# EAGLE design untitled (EAGLE 9.6.2)
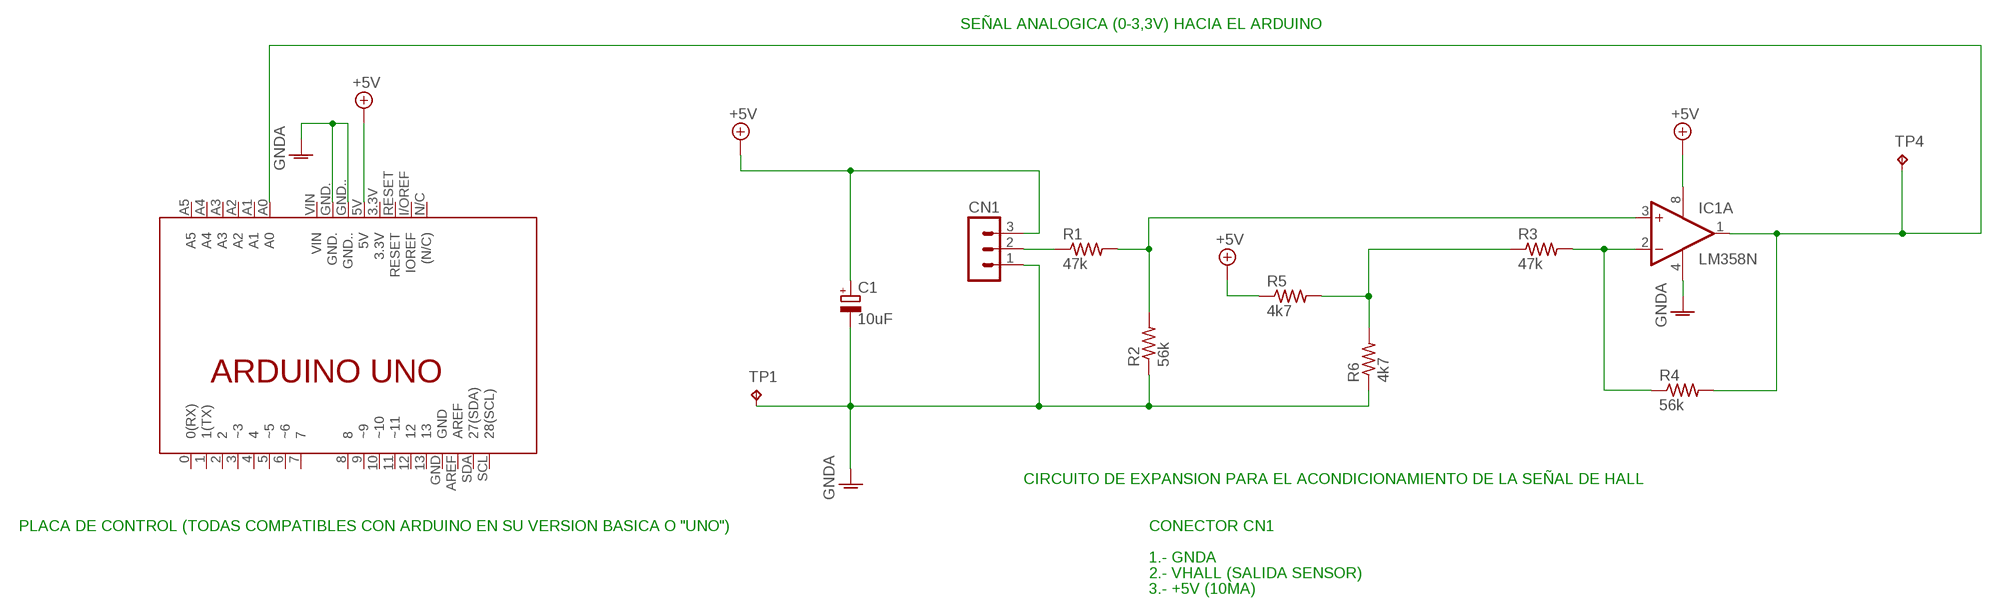
[diagram p0: schematic, sheet 1]

## Parts
C1  10uF  CPOL-EUE5-10.5  [E5-10,5]
CN1  MA03-1  [MA03-1]
IC1  LM358N  [DIL08]
R1  47k  R-US_R1206W  [R1206W]
R2  56k  R-US_R1206W  [R1206W]
R3  47k  R-US_R1206W  [R1206W]
R4  56k  R-US_R1206W  [R1206W]
R5  4k7  R-US_R1206W  [R1206W]
R6  4k7  R-US_R1206W  [R1206W]
TP1  TPPAD1-13Y  [P1-13Y]
TP4  TPPAD1-13Y  [P1-13Y]
U$1  ARDUINO_UNO_SPL  [ARDUINO_UNO_REC]

## Nets
+5V: C1.+ CN1.3 IC1.8(P:V+) R5.1 U$1.5V
GNDA: C1.- CN1.1 IC1.4(P:V-) R2.1 R6.1 TP1.TP U$1.GND. U$1.GND..
N$1: CN1.2 R1.1
N$2: R3.1 R5.2 R6.2
N$3: IC1.3(A:+IN) R1.2 R2.2
N$4: IC1.2(A:-IN) R3.2 R4.1
N$6: IC1.1(A:OUT) R4.2 TP4.TP U$1.A0
Unconnected: IC1.5(B:+IN) IC1.6(B:-IN) IC1.7(B:OUT) U$1.0(0(RX)) U$1.1(1(TX)) U$1.2 U$1.3(~3) U$1.3.3V U$1.4 U$1.5(~5) U$1.6(~6) U$1.7 U$1.8 U$1.9(~9) U$1.10(~10) U$1.11(~11) U$1.12 U$1.13 U$1.A1 U$1.A2 U$1.A3 U$1.A4 U$1.A5 U$1.AREF U$1.GND U$1.I/OREF(IOREF) U$1.N/C((N/C)) U$1.RESET U$1.SCL(28(SCL)) U$1.SDA(27(SDA)) U$1.VIN

## Notes on the sheet
- SEÑAL ANALOGICA (0-3,3V) HACIA EL ARDUINO
- CIRCUITO DE EXPANSION PARA EL ACONDICIONAMIENTO DE LA SEÑAL DE HALL
- PLACA DE CONTROL (TODAS COMPATIBLES CON ARDUINO EN SU VERSION BASICA O "UNO") | CONECTOR CN1
- 1.- GNDA
- 2.- VHALL (SALIDA SENSOR)
- 3.- +5V (10MA)

## Library data of the parts
C1 = shield_flotador:CPOL-EU: POLARIZED CAPACITOR, European symbol
CN1 = con-lstb:MA03-1: PIN HEADER; OC_FARNELL: unknown; OC_NEWARK: unknown
IC1 = shield_flotador:LM358: OP AMP also LM158; LM258; LM2904 Source: http://cache.national.com/ds/LM/LM158.pdf
R1-R6 = shield_flotador:R-US_: RESISTOR, American symbol
TP1 TP4 = shield_flotador:TP: Test pad
U$1 = shield_flotador:ARDUINO_UNO_SPL

## Board
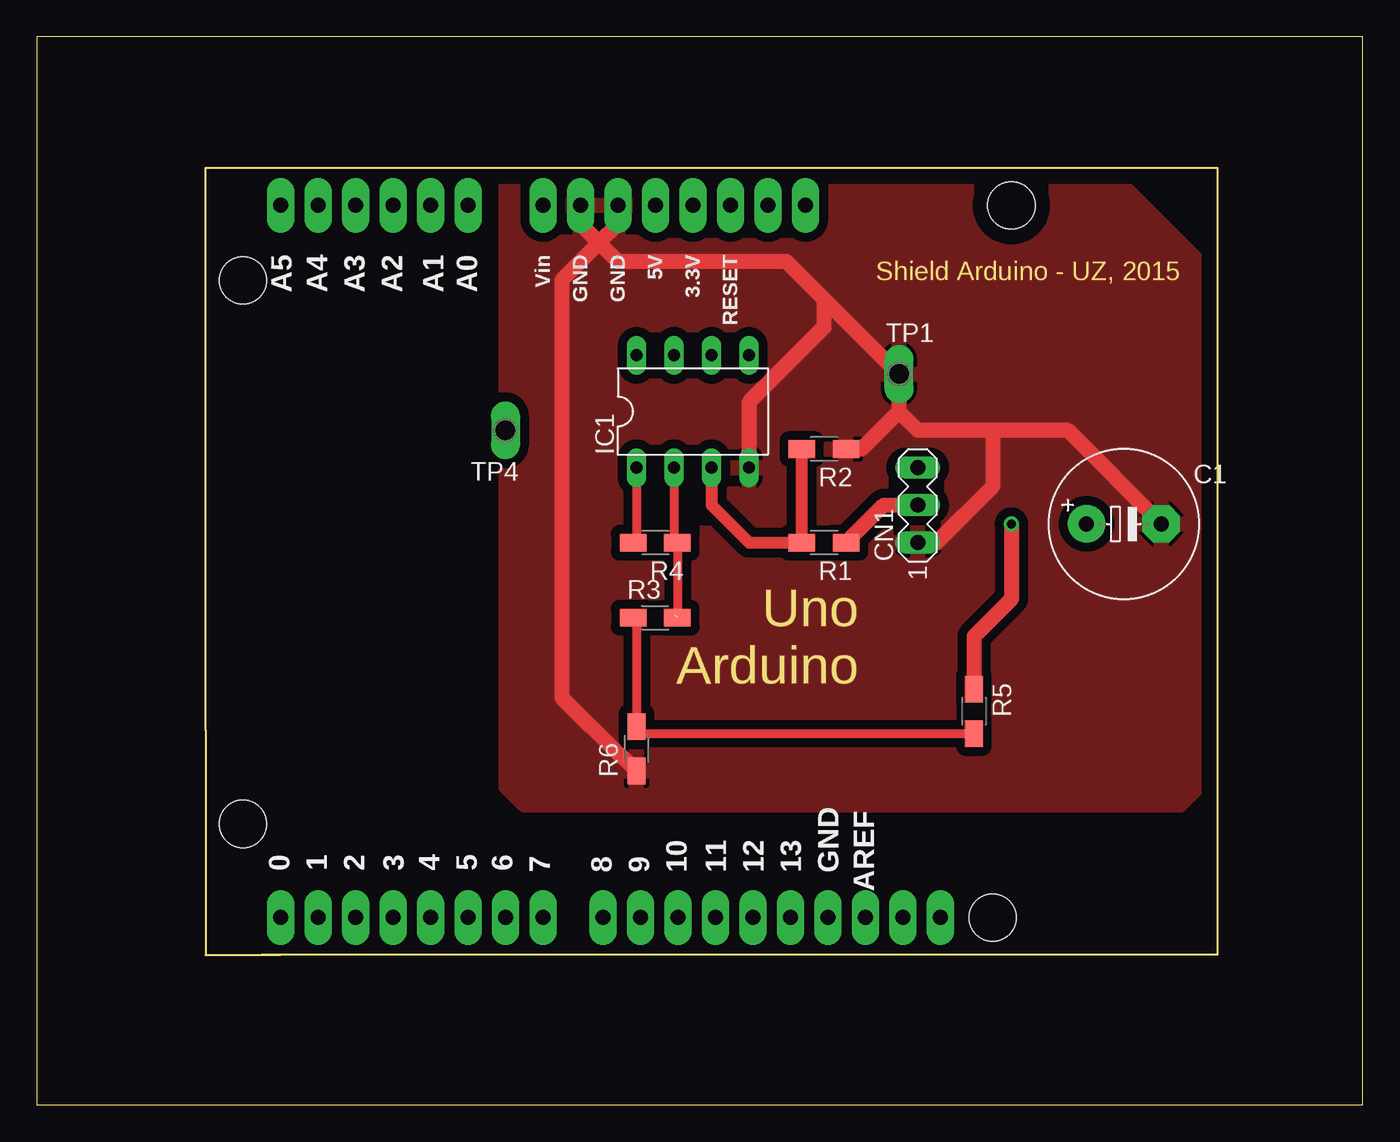
[diagram p1: board, top side]
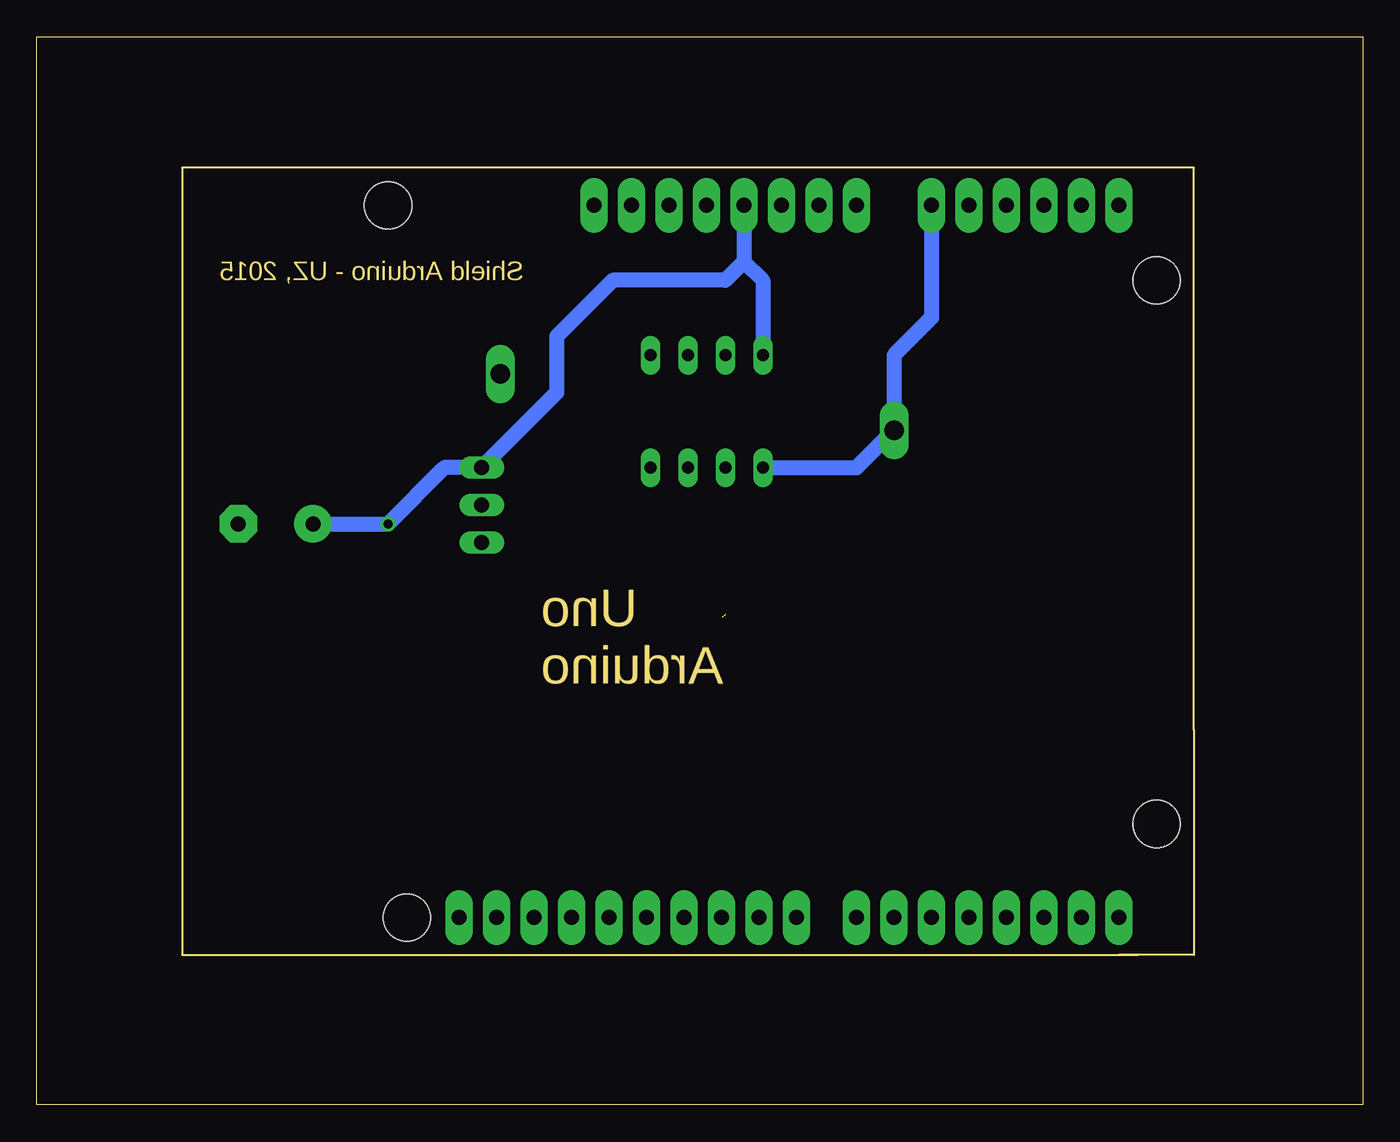
[diagram p2: board, bottom side, seen from below]

Size 89.84 x 72.38 mm. Coordinates in mm from the lower left corner, seen from the top.
Outline: 0,0 89.84,0 89.84,72.38 0,72.38 0,0
Copper layers (1*16): Top 0.035mm / dielectric 1.5mm / Bottom 0.035mm
Design rules "default *": minimum track width 24mil, minimum drill 24mil, track to track 24mil, track to pad 24mil, pad to pad 24mil, via to via 24mil, smd to smd 24mil, copper to edge 40mil, drill to drill 6mil, minimum pad ring 10mil, minimum via ring 8mil, stop-mask expansion 4mil, vias tented up to drill 0mil, thermal gap 10mil

### Footprints (pad centres in the part's own frame; a part is rotated, then mirrored left to right if it is on the bottom)
E5-10,5 = drill 1.016 pad 2.54: + -2.54,0 | drill 1.016 pad 2.54 octagon: - 2.54,0
MA03-1 = drill 1.016 long: 1 -2.54,0; 2 0,0; 3 2.54,0
DIL08 = drill 0.813 pad 1.27 long: 1 -3.81,-3.81; 2 -1.27,-3.81; 3 1.27,-3.81; 4 3.81,-3.81; 5 3.81,3.81; 6 1.27,3.81; 7 -1.27,3.81; 8 -3.81,3.81
R1206W = smd 1.8 x 1.2: 1 -1.499,0; 2 1.499,0
P1-13Y = drill 1.321 pad 1.905 long: TP 0,0
ARDUINO_UNO_REC = drill 1.016 pad 1.88 long: 0 50.8,12.7; 1 48.26,12.7; 2 45.72,12.7; 3 43.18,12.7; 3.3V 22.86,-35.56; 4 40.64,12.7; 5 38.1,12.7; 5V 25.4,-35.56; 6 35.56,12.7; 7 33.02,12.7; 8 28.956,12.7; 9 26.416,12.7; 10 23.876,12.7; 11 21.336,12.7; 12 18.796,12.7; 13 16.256,12.7; A0 38.1,-35.56; A1 40.64,-35.56; A2 43.18,-35.56; A3 45.72,-35.56; A4 48.26,-35.56; A5 50.8,-35.56; AREF 11.176,12.7; GND 13.716,12.7; GND. 30.48,-35.56; GND.. 27.94,-35.56; I/OREF 17.78,-35.56; N/C 15.24,-35.56; RESET 20.32,-35.56; SCL 6.096,12.7; SDA 8.636,12.7; VIN 33.02,-35.56 | hole 3.2: 53.34,-30.48; 53.34,6.35; 2.54,12.7; 1.27,-35.56

### Placement (x,y rotation side)
C1  73.66,39.37 0 top
CN1  59.69,40.64 90 top
IC1  44.45,46.99 0 top
R1  53.34,38.1 180 top
R2  53.34,44.45 180 top
R3  41.91,33.02 0 top
R4  41.91,38.1 180 top
R5  63.5,26.67 270 top
R6  40.64,24.13 90 top
TP1  58.42,49.53 0 top
TP4  31.75,45.72 180 top
U$1  67.31,25.4 180 top

### Tracks (layer width: path | path; a pad name or v marks a point on that pad's centre or on a via)
+5V  (via drill 0.61)
  Top 1.016: v66.04,39.37 66.04,34.29 63.5,31.75 R5.1
  Bottom 1.016: U$1.5V 41.91,57.15 | 41.91,57.15 40.64,55.88 IC1.8 | 41.91,57.15 43.18,55.88 50.8,55.88 54.61,52.07 54.61,48.26 CN1.3 62.23,43.18 v66.04,39.37 C1.+
GNDA
  Top 1.016: 53.34,54.61 TP1.TP 58.42,46.99 | 53.34,54.61 50.8,57.15 39.37,57.15 38.1,58.42 | U$1.GND. 36.83,59.69 38.1,58.42 | U$1.GND.. 39.37,59.69 38.1,58.42 | 58.42,46.99 55.88,44.45 R2.1 | 58.42,46.99 59.69,45.72 64.77,45.72 | C1.- 69.85,45.72 64.77,45.72 | 64.77,45.72 64.77,41.91 60.96,38.1 CN1.1 | 53.34,54.61 53.34,52.71 48.26,47.62 IC1.4 | 38.1,58.42 35.56,55.88 35.56,27.63 39.58,23.61 39.66,23.61 R6.1
  pour Top: 31.75,62.23 31.75,21.59 33.02,20.32 77.47,20.32 78.74,21.59 78.74,57.15 73.66,62.23
N$1
  Top 1.016: R1.1 57.38,40.64 CN1.2
N$2
  Top 0.61: 40.64,32.79 R6.2 41.1,25.17 R5.2
  Top 0.813: R3.1 40.64,32.79 | R6.2 40.87,25.4
N$3
  Top 0.813: IC1.3 45.72,40.64 48.26,38.1 R1.2 R2.2
N$4  (1 unrouted)
  Top 0.61: IC1.2 43.18,38.33 R4.1 43.41,33.46 43.18,33.23
N$6
  Top 0.61: IC1.1 40.64,38.33 R4.2
  Bottom 1.016: U$1.A0 29.21,53.34 31.75,50.8 TP4.TP 34.29,43.18 IC1.1